# Altium schematic sheet SingleBoardDrone_Pow.SchDoc
size B; SheetNumber: 1; SheetTotal: 5
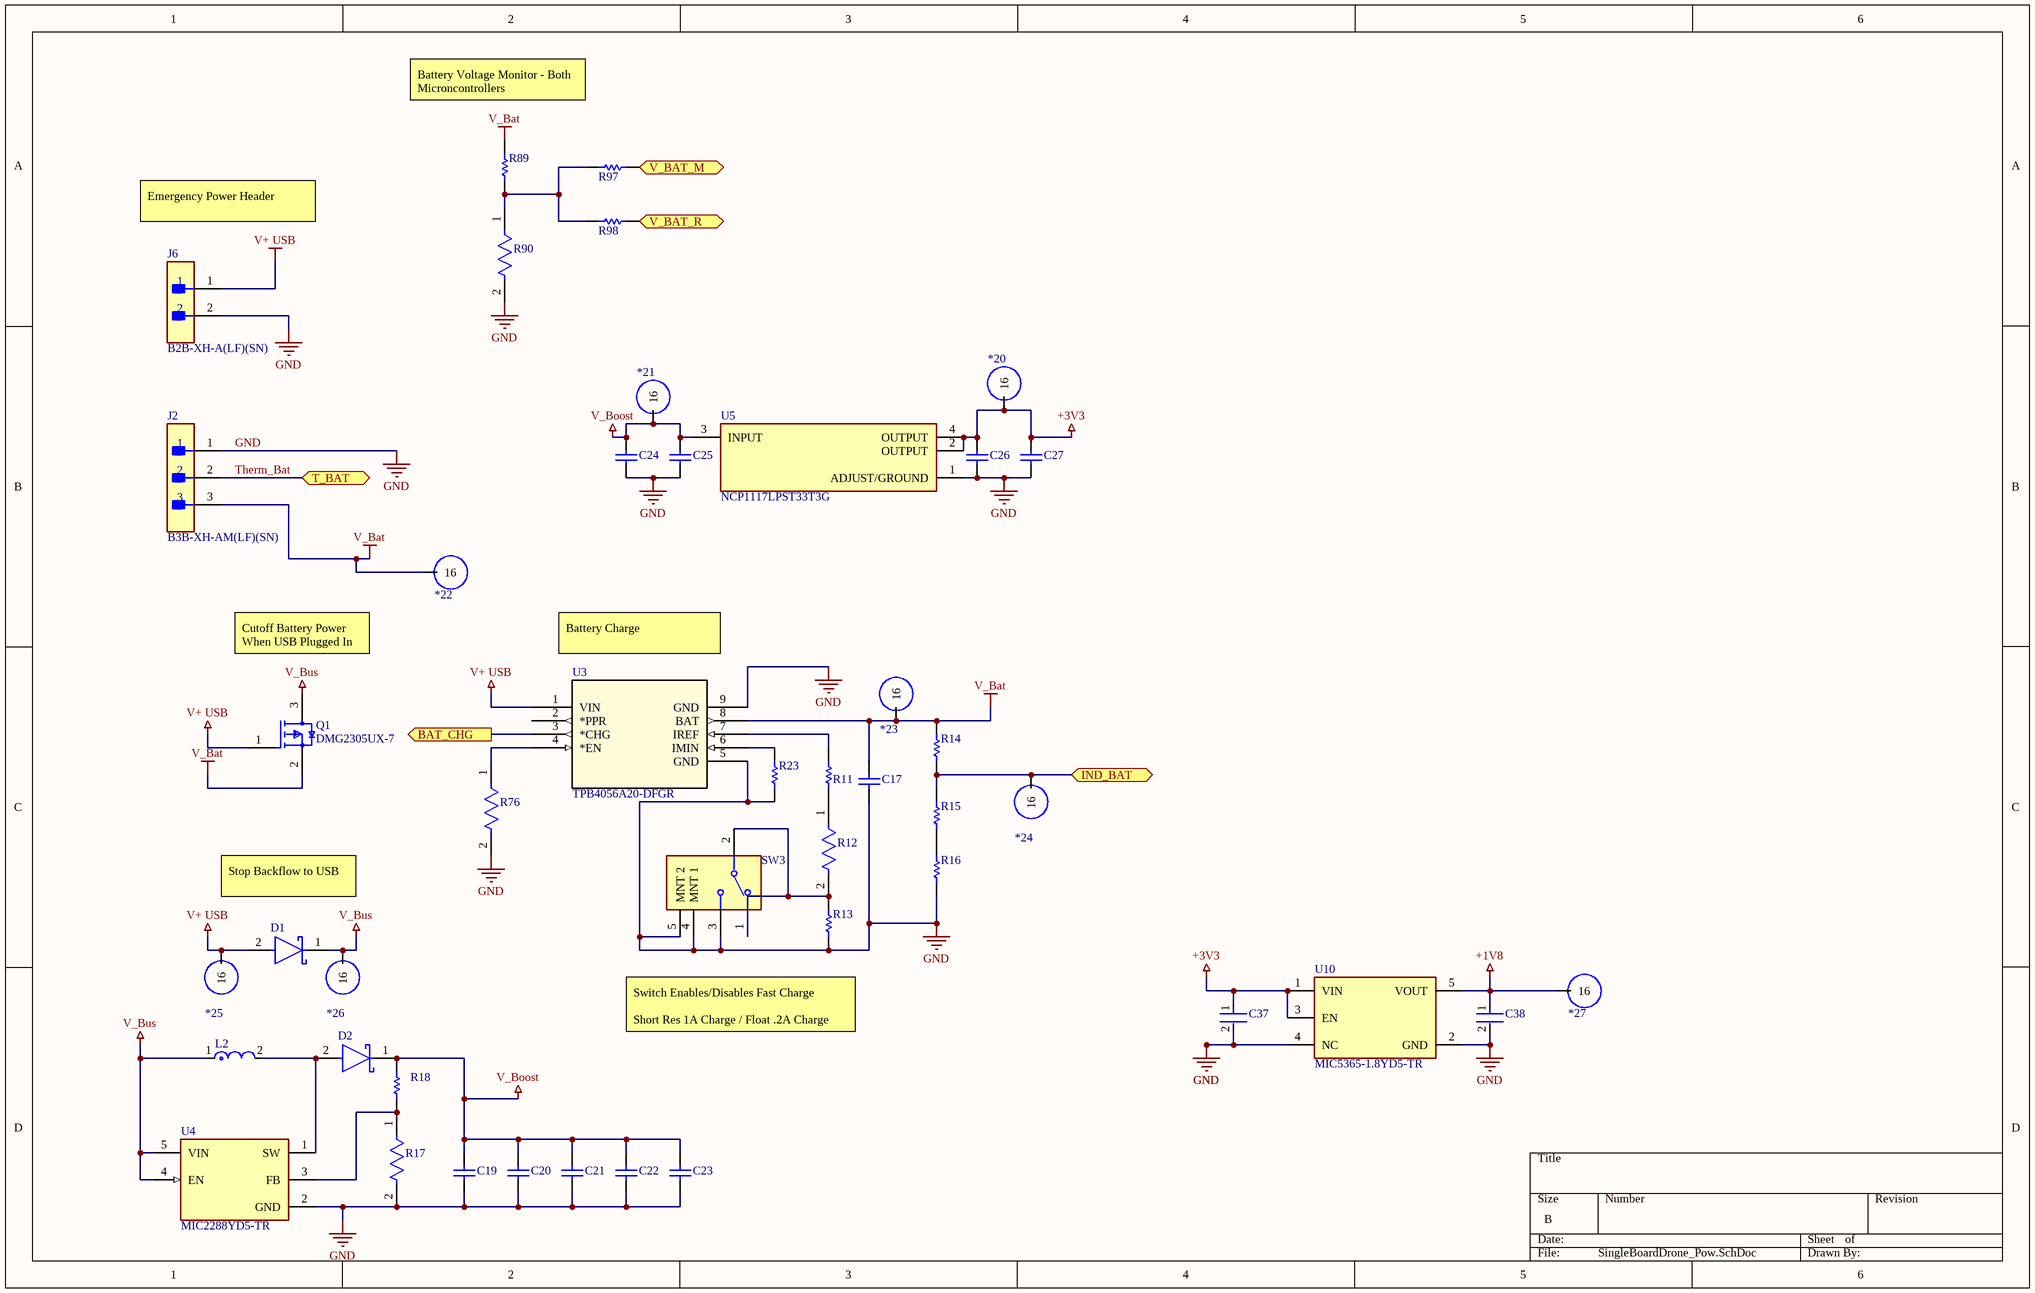
[diagram p0: SingleBoardDrone_Pow.SchDoc]

## Parts
*20  Component_1  [Test_Point]  (value not drawn)  (no BOM)
*21  Component_1  [Test_Point]  (value not drawn)  (no BOM)
*22  Component_1  [Test_Point]  (value not drawn)  (no BOM)
*23  Component_1  [Test_Point]  (value not drawn)  (no BOM)
*24  Component_1  [Test_Point]  (value not drawn)  (no BOM)
*25  Component_1  [Test_Point]  (value not drawn)  (no BOM)
*26  Component_1  [Test_Point]  (value not drawn)  (no BOM)
*27  Component_1  [Test_Point]  (value not drawn)  (no BOM)
C17  CL10A475KQ8NNNC  [CAPC1608X90X30LL10T20]  (value not drawn)
C19  CL10A475KQ8NNNC  [CAPC1608X90X30LL10T20]  (value not drawn)
C20  CL10A475KQ8NNNC  [CAPC1608X90X30LL10T20]  (value not drawn)
C21  CL10A475KQ8NNNC  [CAPC1608X90X30LL10T20]  (value not drawn)
C22  CL10A475KQ8NNNC  [CAPC1608X90X30LL10T20]  (value not drawn)
C23  CL10A475KQ8NNNC  [CAPC1608X90X30LL10T20]  (value not drawn)
C24  CL10A475KQ8NNNC  [CAPC1608X90X30LL10T20]  (value not drawn)
C25  CL10A475KQ8NNNC  [CAPC1608X90X30LL10T20]  (value not drawn)
C26  CL10A475KQ8NNNC  [CAPC1608X90X30LL10T20]  (value not drawn)
C27  CL10A475KQ8NNNC  [CAPC1608X90X30LL10T20]  (value not drawn)
C37  CGA3E1X7R1E105K080AC  [FP-CGA3E-0_3-0_1-IPC_A]  (value not drawn)
C38  CGA3E1X7R1E105K080AC  [FP-CGA3E-0_3-0_1-IPC_A]  (value not drawn)
D1  PMEG3020DEP,115  [FP-SOD128-MFG]  (value not drawn)
D2  PMEG3020DEP,115  [FP-SOD128-MFG]  (value not drawn)
J2  B3B-XH-AM(LF)(SN)  [FP-B3B-XH-AM_LF_SN-MFG]
J6  B2B-XH-A(LF)(SN)  [FP-B2B-XH-A_LF_SN-MFG]
L2  VLS5045EX-100M  [FP-VLS5045EX-100M-MFG]  (value not drawn)
Q1  DMG2305UX-7  [FP-SOT23-IPC_B]
R11  ERJ-6ENF2000V  [RESC2013X70X40ML20T20]  (value not drawn)
R12  RMCF0402JT1K00  [FP-RMCF0402-IPC_B]  (value not drawn)
R13  CRCW08055K00FKTA  [RESC2013X50X30ML20T20]  (value not drawn)
R14  CRCW08055K00FKTA  [RESC2013X50X30ML20T20]  (value not drawn)
R15  CRCW08055K00FKTA  [RESC2013X50X30ML20T20]  (value not drawn)
R16  CRCW08055K00FKTA  [RESC2013X50X30ML20T20]  (value not drawn)
R17  RMCF0402JT1K00  [FP-RMCF0402-IPC_B]  (value not drawn)
R18  CRCW08055K00FKTA  [RESC2013X50X30ML20T20]  (value not drawn)
R23  CRCW08055K00FKTA  [RESC2013X50X30ML20T20]  (value not drawn)
R76  RC0402FR-070RL  [FP-RC0402-0_4-IPC_A]  (value not drawn)
R89  CRCW08055K00FKTA  [RESC2013X50X30ML20T20]  (value not drawn)
R90  RMCF0603JG10K0  [FP-RMCF0603-MFG]  (value not drawn)
R97  ERJ-6ENF2000V  [RESC2013X70X40ML20T20]  (value not drawn)
R98  ERJ-6ENF2000V  [RESC2013X70X40ML20T20]  (value not drawn)
SW3  1825232-1  [FP-1825232-1-MFG]  (value not drawn)
U3  TPB4056A20-DFGR  [DFN2X2-8_TPK]
U4  MIC2288YD5-TR  [FP-TSOT-5LD-PL-1-MFG]
U5  NCP1117LPST33T3G  [FP-318H-MFG]
U10  MIC5365-1.8YD5-TR  [FP-TSOT-5LD-PL-1-MFG]

## Ports
BAT_CHG (out, see SingleBoardDrone_RP2350[3B]), IND_BAT (bidir), T_BAT (bidir, see SingleBoardDrone_RP2350[3B]), V_BAT_M (bidir, see SingleBoardDrone_RP2350[3B]), V_BAT_R (bidir, see SingleBoardDrone_RF[3B])

## Nets
+1V8: *27.TP1(16) C38.1 U10.5(VOUT)
+3V3: *20.TP1(16) C26.1 C27.1 C37.1 U5.2(OUTPUT) U5.4(OUTPUT) U10.1(VIN) U10.3(EN)
GND: C17.2 C19.2 C20.2 C21.2 C22.2 C23.2 C24.2 C25.2 C26.2 C27.2 C37.2 C38.2 J2.1 J6.2 R13.2 R16.2 R17.2 R23.2 R76.2 R90.2 SW3.3 SW3.4(MNT_1) SW3.5(MNT_2) U3.5(GND) U3.9(GND) U4.2(GND) U5.1(ADJUST/GROUND) U10.2(GND) U10.4(NC)
V+ USB: *25.TP1(16) D1.2(A) J6.1 Q1.1(GATE) U3.1(VIN)
V_Bat: *22.TP1(16) *23.TP1(16) C17.1 J2.3 Q1.2(SOURCE) R14.1 R89.1 U3.8(BAT)
V_Boost: *21.TP1(16) C19.1 C20.1 C21.1 C22.1 C23.1 C24.1 C25.1 D2.1(C) R18.1 U5.3(INPUT)
V_Bus: *26.TP1(16) D1.1(C) L2.1 Q1.3(DRAIN) U4.4(EN) U4.5(VIN)
BAT_CHG: U3.3(*CHG) ; port BAT_CHG
IND_BAT: *24.TP1(16) R14.2 R15.1 ; port IND_BAT
Therm_Bat: J2.2 ; port T_BAT
V_BAT_M: R97.1 ; port V_BAT_M
V_BAT_R: R98.1 ; port V_BAT_R
NetD2_2: D2.2(A) L2.2 U4.1(SW)
NetR11_1: R11.1 U3.7(IREF)
NetR11_2: R11.2 R12.1
NetR12_2: R12.2 R13.1 SW3.1 SW3.2
NetR15_2: R15.2 R16.1
NetR17_1: R17.1 R18.2 U4.3(FB)
NetR23_1: R23.1 U3.6(IMIN)
NetR76_1: R76.1 U3.4(*EN)
NetR89_2: R89.2 R90.1 R97.2 R98.2

Not connected (* = marked no-connect by the designer): U3 2(*PPR)

## Notes on the sheet
- Battery Voltage Monitor - Both Microncontrollers
- Emergency Power Header
- Cutoff Battery Power When USB Plugged In
- Battery Charge
- Stop Backflow to USB
- (near R13) Switch Enables/Disables Fast Charge
  Short Res 1A Charge / Float .2A Charge

## Library data of the parts
C17 C19-C27 = CMP-2000-06090-1: Chip Capacitor, 4.7 uF, +/- 10%, 6.3 V, -55 to 85 degC, 0603 (1608 Metric), RoHS, Tape and Reel; Manufacturer: Samsung Electro-Mechanics; Dielectric: X5R; Capacitance: 4700000pF; Rated Voltage: 6.3V; Manufacturer URL: http://www.samsungsem.com/global/index.jsp; Case Size/Dimension: 0603; Package Description: 2-Pin Surface Mount Device, Body 1.60 x 0.80 mm; Datasheet Version: 07/2016; Datasheet URL: http://www.samsungsem.com/kr/support/product-search/mlcc/__icsFiles/afieldfile/2016/08/18/S_CL10A475KQ8NNNC.pdf; Tolerance (%): ±10%; Mounting Technology: SurfaceMount; Package Reference: 0603
C37 C38 = CMP-08246-001507-1: Cap Ceramic 1uF 25V X7R 10% Pad SMD 0603 +125°C Automotive T/R; Dielectric: X7R; Capacitance: 1uF; Voltage Rating: 25V; Thickness: 0.035inch; Width: 0.031inch; Ratings: AEC-Q200; Case Code (Metric): 1608; REACH SVHC: No SVHC; Voltage: 25V; Composition: Ceramic; Min Operating Temperature: -55°C; Termination: SMD/SMT; Depth: 0.8mm; Max Operating Temperature: 125°C; Mount: Surface Mount; Weight: 7.1E-05oz; Package Quantity: 4000; Tolerance: 10%; Packaging: Tape and Reel; Lead Free: Lead Free; Case/Package: 0603; Length: 1.6mm; Height: 0.8mm; Case Code (Imperial): 0603; Voltage Rating (DC): 25V
D1 D2 = CMP-14398-000018-1: DIODE SCHOTTKY 30V 2A SOD128
J2 = CMP-17438-000009-1: CONN HEADER VERT 3POS 2.5MM; Max Current Rating: 3A; Gender: Male; Max Voltage Rating (AC): 250V; Connector Type: Male Pin; Pitch: 0.098inch; Number of Positions: 3; Contact Resistance: 20mR; Termination: Press-Fit; Housing Color: White; Housing Material: Polyamide; Orientation: Straight; Contact Material: Brass; Contact Type: Male Pin; Color: Natural; Packaging: Bulk; Lead Free: Lead Free; Depth: 5.75mm; Number of Rows: 1; Contact Plating: Tin; Length: 9.9mm; Max Operating Temperature: 85°C; Series: XH; Min Operating Temperature: -25°C; Fastening Type: Detent; Mount: Through Hole
J6 = CMP-2000-05888-3: CONN HEADER VERT 2POS 2.5MM; Current Rating: 3A; Voltage Rating: 250V; Number of Contacts: 2; Contact Resistance: 20mR; Wire/Cable Gauge: 22AWG; Insulation Resistance: 1GR; Connector Type: Male Pin; Packaging: Bulk; Contact Material: Brass; Lead Free: Lead Free; Orientation: Straight; Contact Plating: Tin; Max Current Rating: 3A; Termination: Solder; Fastening Type: Detent; Depth: 5.75mm; Housing Material: Polyamide; REACH SVHC: No SVHC; Series: XH; Voltage Rating (AC): 250V; Number of Positions: 2; Color: Natural; Contact Type: Male Pin; Max Voltage Rating (DC): 250V; Pitch: 2.5mm; Lead Pitch: 2.5mm; Mount: Through Hole; Max Operating Temperature: 85°C; Length: 7.4mm; Max Voltage Rating (AC): 250V; Min Operating Temperature: -25°C; Number of Rows: 1; Housing Color: White
L2 = CMP-08253-000037-1: FIXED IND 10UH 2.5A 79.3 MOHM; Core Material: Ferrite; Test Frequency: 100kHz; Shielding: Shielded; DC Resistance (DCR): 61mR; Tolerance: 20%; Mount: Surface Mount; Current Rating: 2.5A; Case/Package: Nonstandard; Height - Seated (Max): 0.177inch; Min Operating Temperature: -40°C; Resistor Type: Wirewound; Max Operating Temperature: 105°C; Length: 0.197inch; Packaging: Tape and Reel; Width: 0.197inch; Inductance: 10uH; RoHS Compliant: Yes
Q1 = CMP-1693-00002-4: MOSFET P-CH 20V 4.2A SOT23; Turn-On Delay Time: 10.8ns; Turn-Off Delay Time: 79.3ns; Threshold Voltage: -900mV; Rise Time: 13.7ns; Gate to Source Voltage (Vgs): 8V; Rds On Max: 52mR; Element Configuration: Single; Fall Time: 34.7ns; Max Power Dissipation: 1.4W; Drain to Source Resistance: 200mR; Number of Channels: 1; Input Capacitance: 808pF; Lead Free: Lead Free; Number of Pins: 3; Length: 3mm; Continuous Drain Current (ID): 4.2A; Contact Plating: Tin; Mount: Surface Mount; Weight: 0.000282oz; Min Operating Temperature: -55°C; Package Quantity: 3000; Drain to Source Voltage (Vdss): 20V; On-State Resistance: 52MR; Max Operating Temperature: 150°C; Height: 1.1mm; REACH SVHC: No SVHC; Packaging: Tape and Reel; Radiation Hardening: No; Case/Package: SOT-23; Width: 1.4mm
R11 R97 R98 = CMP-2001-00025-1: Manufacturer: Panasonic; Part Number: ERJ-6ENF2000V
R12 R17 = CMP-26527-000131-1: 1kΩ ±5% 0.063W 0402 Thick Film Chip Resistor AEC-Q200 compliant; Power Rating: 62.5mW; Max Power Dissipation: 63mW; Temperature Coefficient: 100ppm/°C; Resistance: 1kR; Mount: Surface Mount; Min Operating Temperature: -55°C; Construction: Rectangular; Case/Package: 0402; Contact Plating: Tin; Case Code (Metric): 1005; Features: Automotive AEC-Q200; Series: RMCF; Lead Free: Lead Free; Length: 1mm; Case Code (Imperial): 0402; Depth: 0.5mm; Resistor Type: Thick Film; Packaging: Tape and Reel; Height: 0.016inch; Width: 0.02inch; Tolerance: 5%; Size Code: 0402; RoHS Compliant: Yes; Number of Terminations: 2; Max Operating Temperature: 155°C; Radiation Hardening: No; Military Standard: Not
R13-R16 R18 R23 R89 = CMP-2001-04239-1: Manufacturer: Vishay Dale; Part Number: CRCW08055K00FKTA
R76 = CMP-2002-07342-2: RES SMD 0 OHM JUMPER 1/16W 0402; Resistance: 0R; Temperature Coefficient: 200ppm/°C; Tolerance: 1%; Power Rating: 62.5mW; Voltage Rating: 50V; Max Power Dissipation: 63mW; Features: Moisture Resistant; Length: 1mm; Case Code (Metric): 1005; Series: RC; RoHS Compliant: Yes; Resistor Type: Thick Film; Height: 0.35mm; Min Operating Temperature: -55°C; Case Code (Imperial): 0402; Number of Terminations: 2; Contact Plating: Tin; Case/Package: 0402; Size Code: 0402; Termination: SMD/SMT; Max Operating Temperature: 155°C; Width: 0.5mm; Mount: Surface Mount; Lead Free: Lead Free; Packaging: Tape and Reel; Radiation Hardening: No
R90 = CMP-26527-000153-1: 10kΩ ±5% 0.1W 0603 Thick Film Chip Resistor AEC-Q200 compliant; Temperature Coefficient: 200ppm/°C; Resistance: 10kR; Max Power Dissipation: 100mW; Tolerance: 5%; Case Code (Imperial): 0603; Series: RMCF; Resistor Type: Thick Film; Length: 0.061inch; Features: Automotive AEC-Q200; Height: 0.022inch; Case Code (Metric): 1608; Width: 0.031inch; Number of Terminations: 2; Contact Plating: Tin; Case/Package: 0603; Package Quantity: 1; Max Operating Temperature: 155°C; Mount: Surface Mount; RoHS Compliant: Yes; Radiation Hardening: No; Min Operating Temperature: -55°C; Packaging: Tape and Reel
SW3 = CMP-03405-000001-1: SWITCH SLIDE SPDT 200MA 30V; Manufacturer: TE Connectivity; Contact Current Rating: 0.2A; Contact Resistance: 20mΩ; Electromechanical Life: 10000Cycles; Operating Force: 200gf; Throw Configuration: SPDT; Manufacturer Part Number: 1825232-1; Temperature Range High: +70°C; Height: 3.7mm; ComponentLink2URL: https://www.te.com/commerce/DocumentDelivery/DDEController?Action=showdoc&DocId=Customer+Drawing%7F1825232%7FB2%7Fpdf%7FEnglish%7FENG_CD_1825232_B2.pdf%7F1825232-1; Mount: Through Hole; Mouser Description: Slide Switches SLIDE SWITCH SPDT Right Angle; Package: 1825232-1; Temperature: -20°C to +70°C; Automotive: No; ComponentLink2Description: Datasheet; Lead Free: Yes; Octopart: https://octopart.com/1825232-1-te+connectivity-45209882; Device Class L1: Electromechanical; Digikey Description: SWITCH SLIDE SPDT 200MA 30V; Device Class L3: Slide Switches; Device Class L2: Switches; Voltage Rating Dc: 30V; Temperature Range Low: -20°C; Category: Switch; RoHS: TRUE
U3 = TPB4056A20-DFGR: No Description Available; Manufacturer_Name: 3Peak; Copyright: Copyright (C) 2025 Ultra Librarian. All rights reserved.; Manufacturer_Part_Number: TPB4056A20-DFGR; RefDes: RefDes; Type: Type
U4 = CMP-06325-000011-1: IC REG BOOST ADJ 1.2A TSOT23-5; Number of Outputs: 1; Output Current: 1A; Operating Supply Voltage: 10V; Switching Frequency: 1.2MHz; Output Configuration: Positive; Max Output Voltage: 34V; Min Input Voltage: 2.5V; Synchronous Rectifier: No; Output Type: Adjustable; Max Input Voltage: 10V; Width: 1.6mm; Max Output Current: 1A; Packaging: Tape and Reel; Max Operating Temperature: 125°C; Min Operating Temperature: -40°C; Package Quantity: 3000; Height: 0.87mm; Output Voltage: 34V; Min Output Voltage: 2.5V; Lead Free: Lead Free; Length: 2.9mm; REACH SVHC: No SVHC; Radiation Hardening: No; Min Supply Voltage: 2.5V; Case/Package: TSOT; Number of Pins: 5; Mount: Surface Mount; Topology: Boost
U5 = CMP-07128-000031-1: IC REG LINEAR 3.3V 1A SOT223; Output Type: Fixed; Dropout Voltage: 1.3V; Min Input Voltage: -300mV; Power Supply Rejection Ratio (PSRR): 60dB; Number of Outputs: 1; Reference Voltage: 1.275V; Quiescent Current: 700uA; Max Input Voltage: 18V; Polarity: Positive; Min Current Limit: 1.1A; Height: 1.69mm; Mount: Surface Mount; Min Output Voltage: 3.3V; Case/Package: SOT-223; Length: 6.7mm; Nominal Output Voltage: 3.3V; Output Current: 1A; Number of Regulators: 1; Max Operating Temperature: 125°C; Packaging: Tape and Reel; Number of Pins: 3; Min Operating Temperature: 0°C; Halogen Free: Halogen Free; Contact Plating: Tin; Width: 3.7mm; REACH SVHC: No SVHC; Package Quantity: 1; Output Voltage: 3.3V; Lead Free: Lead Free; Max Output Current: 1A
U10 = CMP-00252-66803184-1: MIC5365-1.8YD5-TR LDO Regulator Pos 1.8V 0.15A 5-Pin TSOT-23 T/R; Polarity: Positive; Number of Regulators: 1; Output Voltage Accuracy: 2%; Min Current Limit: 200mA; Min Input Voltage: 2.5V; Quiescent Current: 39µA; Output Current: 150mA; Dropout Voltage: 180mV; Max Input Voltage: 5.5V; Power Supply Rejection Ratio (PSRR): 80dB; Output Type: Fixed; Mount: Surface Mount; Min Operating Temperature: -40°C; Max Operating Temperature: 125°C; Output Voltage: 1.8V; Case/Package: SOT-23-5; Lifecycle Status: Production; RoHS: Compliant; Lead Free: Lead Free; Number of Outputs: 1; NexarPartId: 66803184; Number of Pins: 23